# EAGLE design LED Sensor Board (EAGLE 6.4)
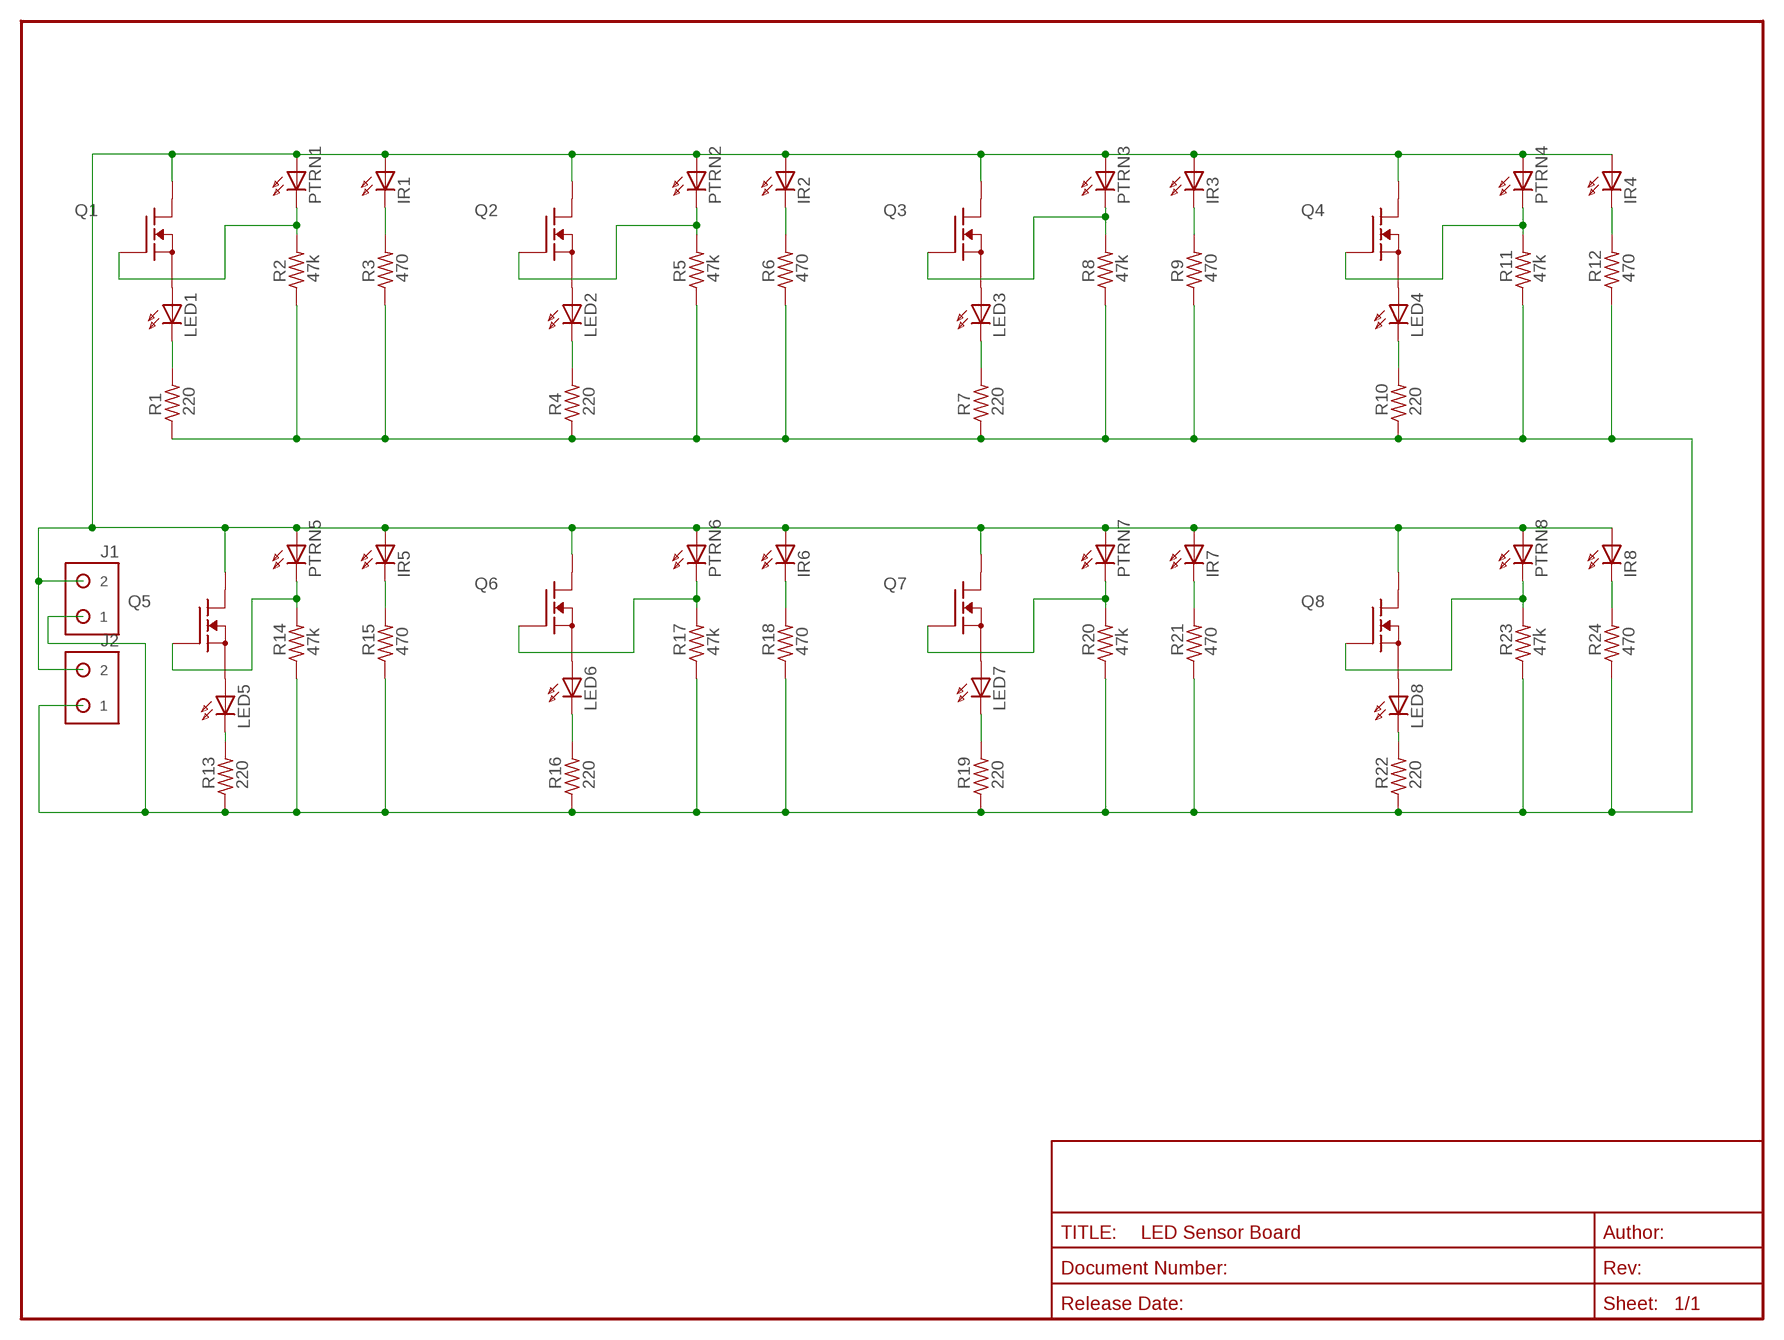
[diagram p0: schematic, sheet 1]

## Parts
IR1  LED-T1-3/4  [LED-5MM]
IR2  LED-T1-3/4  [LED-5MM]
IR3  LED-T1-3/4  [LED-5MM]
IR4  LED-T1-3/4  [LED-5MM]
IR5  LED-T1-3/4  [LED-5MM]
IR6  LED-T1-3/4  [LED-5MM]
IR7  LED-T1-3/4  [LED-5MM]
IR8  LED-T1-3/4  [LED-5MM]
J1  HDR-1X2  [HDR-1X2]
J2  HDR-1X2  [HDR-1X2]
LED1  LED-T1-3/4  [LED-5MM]
LED2  LED-T1-3/4  [LED-5MM]
LED3  LED-T1-3/4  [LED-5MM]
LED4  LED-T1-3/4  [LED-5MM]
LED5  LED-T1-3/4  [LED-5MM]
LED6  LED-T1-3/4  [LED-5MM]
LED7  LED-T1-3/4  [LED-5MM]
LED8  LED-T1-3/4  [LED-5MM]
PTRN1  LED-T1-3/4  [LED-5MM]
PTRN2  LED-T1-3/4  [LED-5MM]
PTRN3  LED-T1-3/4  [LED-5MM]
PTRN4  LED-T1-3/4  [LED-5MM]
PTRN5  LED-T1-3/4  [LED-5MM]
PTRN6  LED-T1-3/4  [LED-5MM]
PTRN7  LED-T1-3/4  [LED-5MM]
PTRN8  LED-T1-3/4  [LED-5MM]
Q1  ZVN2110A  [TO92-]
Q2  ZVN2110A  [TO92-]
Q3  ZVN2110A  [TO92-]
Q4  ZVN2110A  [TO92-]
Q5  ZVN2110A  [TO92-]
Q6  ZVN2110A  [TO92-]
Q7  ZVN2110A  [TO92-]
Q8  ZVN2110A  [TO92-]
R1  220  RES-0207/10  [0207/10]
R2  47k  RES-0207/10  [0207/10]
R3  470  RES-0207/10  [0207/10]
R4  220  RES-0207/10  [0207/10]
R5  47k  RES-0207/10  [0207/10]
R6  470  RES-0207/10  [0207/10]
R7  220  RES-0207/10  [0207/10]
R8  47k  RES-0207/10  [0207/10]
R9  470  RES-0207/10  [0207/10]
R10  220  RES-0207/10  [0207/10]
R11  47k  RES-0207/10  [0207/10]
R12  470  RES-0207/10  [0207/10]
R13  220  RES-0207/10  [0207/10]
R14  47k  RES-0207/10  [0207/10]
R15  470  RES-0207/10  [0207/10]
R16  220  RES-0207/10  [0207/10]
R17  47k  RES-0207/10  [0207/10]
R18  470  RES-0207/10  [0207/10]
R19  220  RES-0207/10  [0207/10]
R20  47k  RES-0207/10  [0207/10]
R21  470  RES-0207/10  [0207/10]
R22  220  RES-0207/10  [0207/10]
R23  47k  RES-0207/10  [0207/10]
R24  470  RES-0207/10  [0207/10]

## Nets
9VSUPPLY: IR1.A IR2.A IR3.A IR4.A IR5.A IR6.A IR7.A IR8.A J1.2 J2.2 PTRN1.A PTRN2.A PTRN3.A PTRN4.A PTRN5.A PTRN6.A PTRN7.A PTRN8.A Q1.1(D) Q2.1(D) Q3.1(D) Q4.1(D) Q5.1(D) Q6.1(D) Q7.1(D) Q8.1(D)
GND: J1.1 J2.1 R1.1 R2.1 R3.1 R4.1 R5.1 R6.1 R7.1 R8.1 R9.1 R10.1 R11.1 R12.1 R13.1 R14.1 R15.1 R16.1 R17.1 R18.1 R19.1 R20.1 R21.1 R22.1 R23.1 R24.1
N$1: LED1.A Q1.3(S)
N$2: LED1.K(C) R1.2
N$3: PTRN1.K(C) Q1.2(G) R2.2
N$4: IR1.K(C) R3.2
N$5: LED2.A Q2.3(S)
N$6: LED2.K(C) R4.2
N$7: PTRN2.K(C) Q2.2(G) R5.2
N$8: IR2.K(C) R6.2
N$9: LED3.A Q3.3(S)
N$10: LED3.K(C) R7.2
N$11: PTRN3.K(C) Q3.2(G) R8.2
N$12: IR3.K(C) R9.2
N$13: LED4.A Q4.3(S)
N$14: LED4.K(C) R10.2
N$15: PTRN4.K(C) Q4.2(G) R11.2
N$16: IR4.K(C) R12.2
N$17: PTRN5.K(C) Q5.2(G) R14.2
N$18: IR5.K(C) R15.2
N$19: LED8.A Q8.3(S)
N$20: LED5.K(C) R13.2
N$21: LED7.A Q7.3(S)
N$22: LED6.K(C) R16.2
N$23: PTRN6.K(C) Q6.2(G) R17.2
N$24: IR6.K(C) R18.2
N$25: LED6.A Q6.3(S)
N$26: LED7.K(C) R19.2
N$27: PTRN7.K(C) Q7.2(G) R20.2
N$28: IR7.K(C) R21.2
N$29: LED5.A Q5.3(S)
N$30: LED8.K(C) R22.2
N$31: PTRN8.K(C) Q8.2(G) R23.2
N$32: IR8.K(C) R24.2

## Library data of the parts
IR1-IR8 LED1-LED8 PTRN1-PTRN8 = Digilent:LED: Discrete LED
J1 J2 = Mechanical:HDR-1X2
Q1-Q8 = will:ZVN2110A
R1-R24 = Digilent:RES: Resistor

## Board
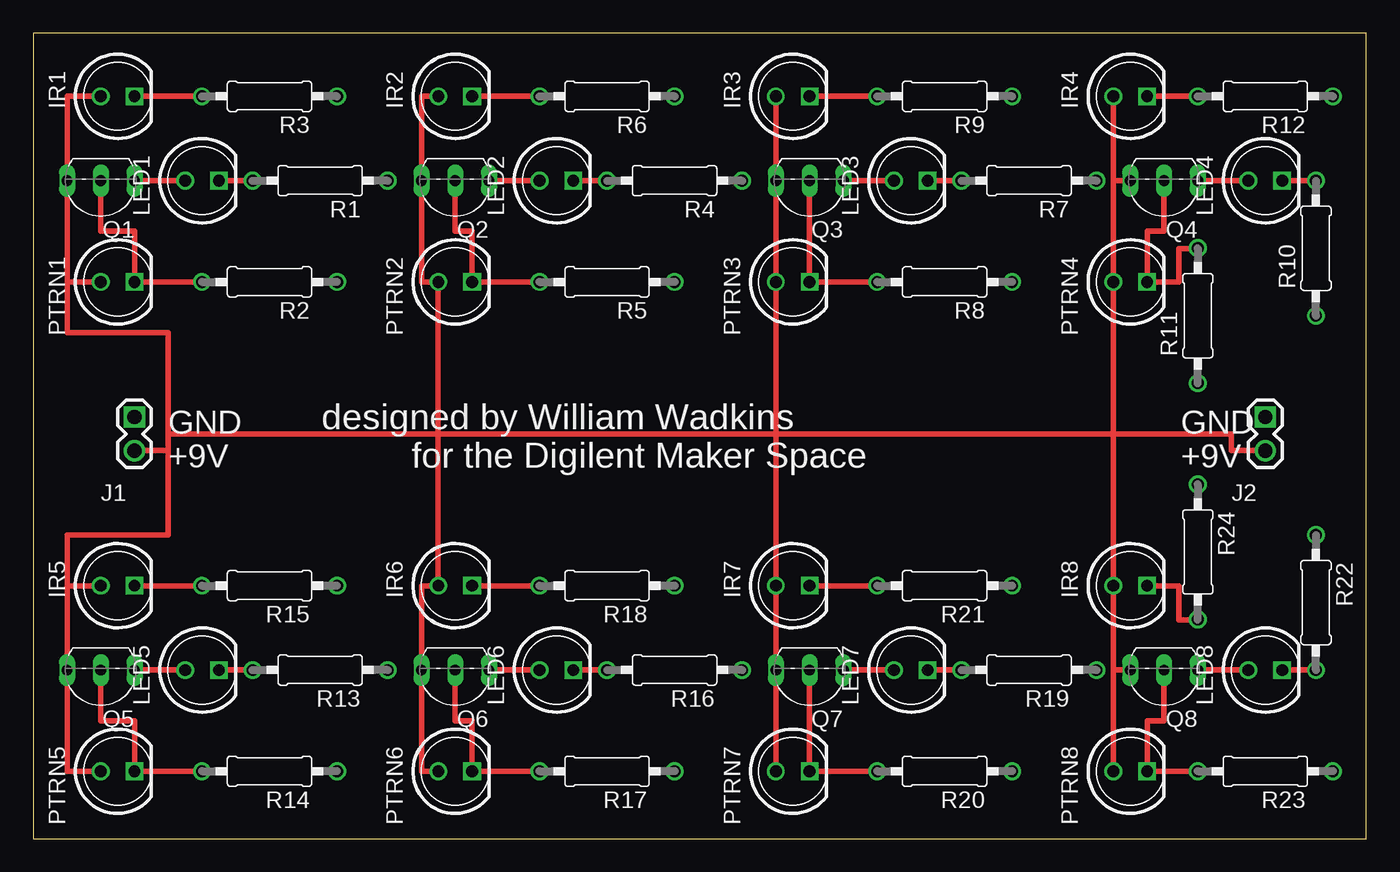
[diagram p1: board, top side]
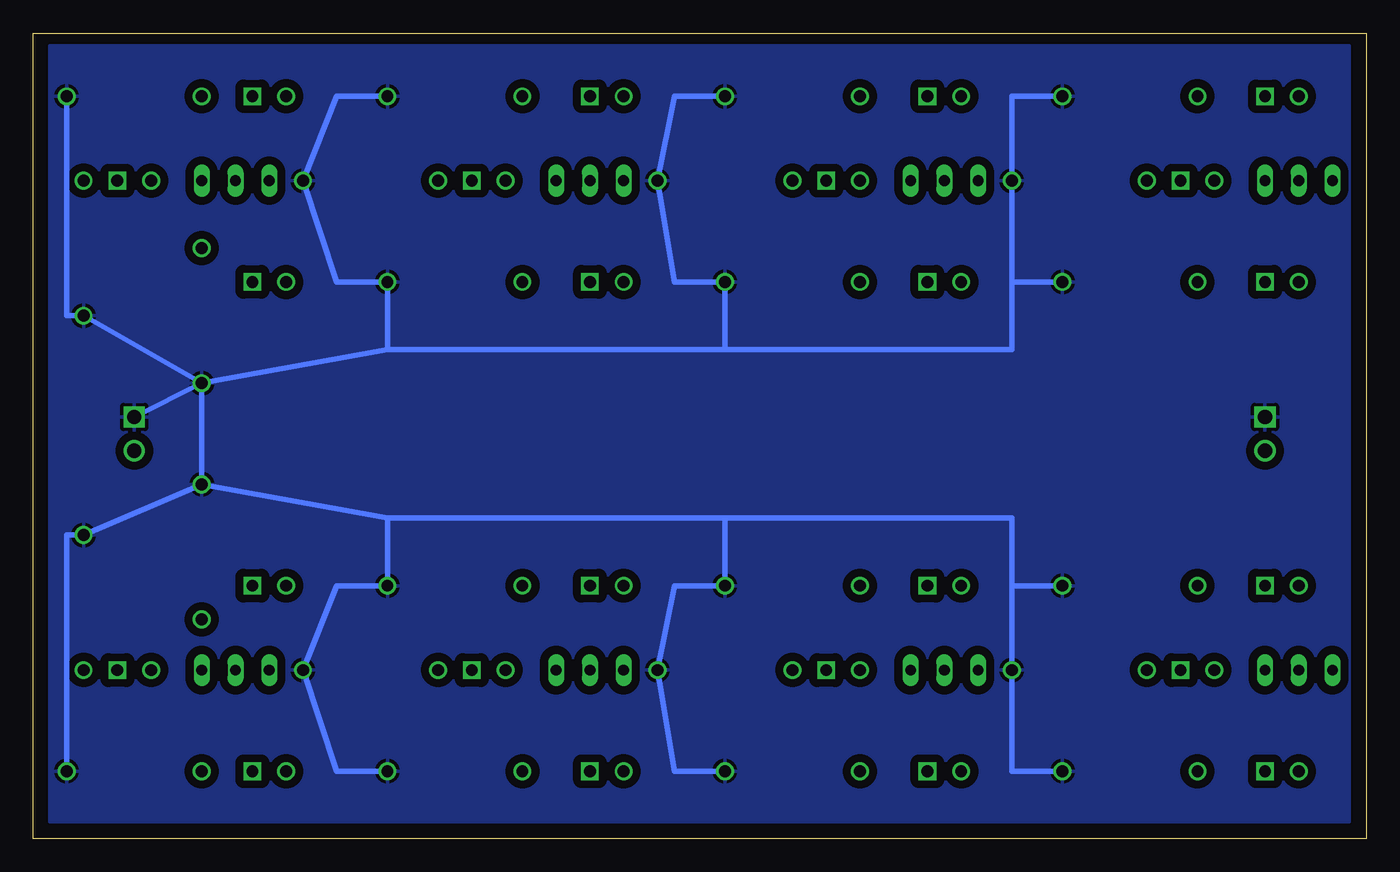
[diagram p2: board, bottom side, seen from below]

Size 100.31 x 60.63 mm. Coordinates in mm from the lower left corner, seen from the top.
Outline: 0,0 100.31,0 100.31,60.63 0,60.63 0,0
Copper layers (1*16): Top 0.0356mm / dielectric 1.5011mm / Bottom 0.0356mm
Design rules "OSHPark": minimum track width 6mil, minimum drill 13mil, track to track 6mil, track to pad 6mil, pad to pad 6mil, via to via 6mil, smd to smd 6mil, copper to edge 15mil, drill to drill 6mil, minimum pad ring 7mil, minimum via ring 7mil, stop-mask expansion 3mil, vias tented up to drill 0mil, thermal gap 10mil

### Footprints (pad centres in the part's own frame; a part is rotated, then mirrored left to right if it is on the bottom)
LED-5MM = drill 0.889: A 0,-1.27 | drill 0.889 square: K 0,1.27
HDR-1X2 = drill 1.067 square: 1 0,1.27 | drill 1.067: 2 0,-1.27
TO92- = drill 0.813 long: 1 2.54,0; 2 0,0; 3 -2.54,0
0207/10 = drill 0.889: 1 -5.08,0; 2 5.08,0

### Placement (x,y rotation side)
IR1  6.35,55.88 270 top
IR2  31.75,55.88 270 top
IR3  57.15,55.88 270 top
IR4  82.55,55.88 270 top
IR5  6.35,19.05 270 top
IR6  31.75,19.05 270 top
IR7  57.15,19.05 270 top
IR8  82.55,19.05 270 top
J1  7.62,30.48 0 top
J2  92.71,30.48 0 top
LED1  12.7,49.53 270 top
LED2  39.37,49.53 270 top
LED3  66.04,49.53 270 top
LED4  92.71,49.53 270 top
LED5  12.7,12.7 270 top
LED6  39.37,12.7 270 top
LED7  66.04,12.7 270 top
LED8  92.71,12.7 270 top
PTRN1  6.35,41.91 270 top
PTRN2  31.75,41.91 270 top
PTRN3  57.15,41.91 270 top
PTRN4  82.55,41.91 270 top
PTRN5  6.35,5.08 270 top
PTRN6  31.75,5.08 270 top
PTRN7  57.15,5.08 270 top
PTRN8  82.55,5.08 270 top
Q1  5.08,49.53 180 top
Q2  31.75,49.53 180 top
Q3  58.42,49.53 180 top
Q4  85.09,49.53 180 top
Q5  5.08,12.7 180 top
Q6  31.75,12.7 180 top
Q7  58.42,12.7 180 top
Q8  85.09,12.7 180 top
R1  21.59,49.53 180 top
R2  17.78,41.91 180 top
R3  17.78,55.88 180 top
R4  48.26,49.53 180 top
R5  43.18,41.91 180 top
R6  43.18,55.88 180 top
R7  74.93,49.53 180 top
R8  68.58,41.91 180 top
R9  68.58,55.88 180 top
R10  96.52,44.45 90 top
R11  87.63,39.37 90 top
R12  92.71,55.88 180 top
R13  21.59,12.7 180 top
R14  17.78,5.08 180 top
R15  17.78,19.05 180 top
R16  48.26,12.7 180 top
R17  43.18,5.08 180 top
R18  43.18,19.05 180 top
R19  74.93,12.7 180 top
R20  68.58,5.08 180 top
R21  68.58,19.05 180 top
R22  96.52,17.78 270 top
R23  92.71,5.08 180 top
R24  87.63,21.59 270 top

### Tracks (layer width: path | path; a pad name or v marks a point on that pad's centre or on a via)
9VSUPPLY
  Top 0.406: IR2.A 29.21,55.88 Q2.1 29.21,41.91 PTRN2.A 30.48,30.48 | 81.28,49.53 PTRN4.A 81.28,30.48 | 81.28,49.53 IR4.A | 81.28,12.7 IR8.A 81.28,30.48 | PTRN5.A 2.54,5.08 Q5.1 2.54,19.05 | 2.54,41.91 PTRN1.A | IR1.A 2.54,55.88 Q1.1 2.54,41.91 | IR5.A 2.54,19.05 | 30.48,30.48 55.88,30.48 | 55.88,30.48 PTRN3.A Q3.1 IR3.A | 55.88,30.48 81.28,30.48 | 55.88,30.48 IR7.A Q7.1 PTRN7.A | 30.48,30.48 IR6.A 29.21,19.05 Q6.1 29.21,5.08 PTRN6.A | 2.54,41.91 2.54,38.1 10.16,38.1 10.16,30.48 | 10.16,30.48 10.16,29.21 | 10.16,29.21 10.16,22.86 2.54,22.86 2.54,19.05 | 30.48,30.48 10.16,30.48 | J1.2 10.16,29.21 | J2.2 90.17,29.21 90.17,30.48 81.28,30.48 | PTRN8.A 81.28,12.7 | 81.28,12.7 Q8.1 | Q4.1 81.28,49.53
GND
  Bottom 0.406: R3.1 26.67,55.88 R1.1 26.67,41.91 | 26.67,41.91 26.67,36.83 48.26,36.83 | R2.1 26.67,41.91 | 48.26,36.83 R5.1 52.07,41.91 R4.1 52.07,55.88 R6.1 | 48.26,36.83 73.66,36.83 | 73.66,36.83 R8.1 77.47,41.91 R7.1 77.47,55.88 R9.1 | 73.66,36.83 R11.1 | R12.1 97.79,39.37 R10.1 R11.1 | R15.1 26.67,19.05 | 26.67,19.05 26.67,24.13 48.26,24.13 | 48.26,24.13 R18.1 52.07,19.05 R16.1 52.07,5.08 R17.1 | 48.26,24.13 73.66,24.13 | 73.66,24.13 R21.1 77.47,19.05 R19.1 77.47,5.08 R20.1 | 73.66,24.13 R24.1 | R24.1 R22.1 97.79,22.86 R23.1 | 26.67,19.05 R13.1 26.67,5.08 R14.1 | R11.1 R24.1 | J2.1 R11.1
  pour Bottom (isolate 0.61): 1.27,59.69 99.06,59.69 99.06,1.27 1.27,1.27
N$1
  Top 0.406: Q1.3 LED1.A
N$2
  Top 0.406: LED1.K R1.2
N$3
  Top 0.406: R2.2 PTRN1.K 7.62,45.72 5.08,45.72 Q1.2
N$4
  Top 0.406: R3.2 IR1.K
N$5
  Top 0.406: Q2.3 LED2.A
N$6
  Top 0.406: LED2.K R4.2
N$7
  Top 0.406: R5.2 PTRN2.K 33.02,45.72 31.75,45.72 Q2.2
N$8
  Top 0.406: IR2.K R6.2
N$9
  Top 0.406: Q3.3 LED3.A
N$10
  Top 0.406: LED3.K R7.2
N$11
  Top 0.406: R8.2 PTRN3.K Q3.2
N$12
  Top 0.406: IR3.K R9.2
N$13
  Top 0.406: Q4.3 LED4.A
N$14
  Top 0.406: R10.2 LED4.K
N$15
  Top 0.406: Q4.2 85.09,45.72 83.82,45.72 PTRN4.K 86.21,41.91 | 86.21,41.91 86.21,41.88 | 86.21,41.91 86.21,44.42 87.63,44.42 R11.2
N$16
  Top 0.406: IR4.K R12.2
N$17
  Top 0.406: R14.2 PTRN5.K 7.62,8.89 5.08,8.89 Q5.2
N$18
  Top 0.406: IR5.K R15.2
N$19
  Top 0.406: Q8.3 LED8.A
N$20
  Top 0.406: LED5.K R13.2
N$21
  Top 0.406: Q7.3 LED7.A
N$22
  Top 0.406: LED6.K R16.2
N$23
  Top 0.406: R17.2 PTRN6.K 33.02,8.89 31.75,8.89 Q6.2
N$24
  Top 0.406: IR6.K R18.2
N$25
  Top 0.406: Q6.3 LED6.A
N$26
  Top 0.406: LED7.K R19.2
N$27
  Top 0.406: R20.2 PTRN7.K Q7.2
N$28
  Top 0.406: IR7.K R21.2
N$29
  Top 0.406: Q5.3 LED5.A
N$30
  Top 0.406: R22.2 LED8.K
N$31
  Top 0.406: R23.2 PTRN8.K 83.82,8.89 85.09,8.89 Q8.2
N$32
  Top 0.406: IR8.K 86.21,19.05 86.21,16.48 87.63,16.48 R24.2

### Text on the board
tPlace: GND | GND | +9V | designed by William Wadkins / for the Digilent Maker Space | +9V